# Altium schematic sheet current-regulation.SchDoc
size A4
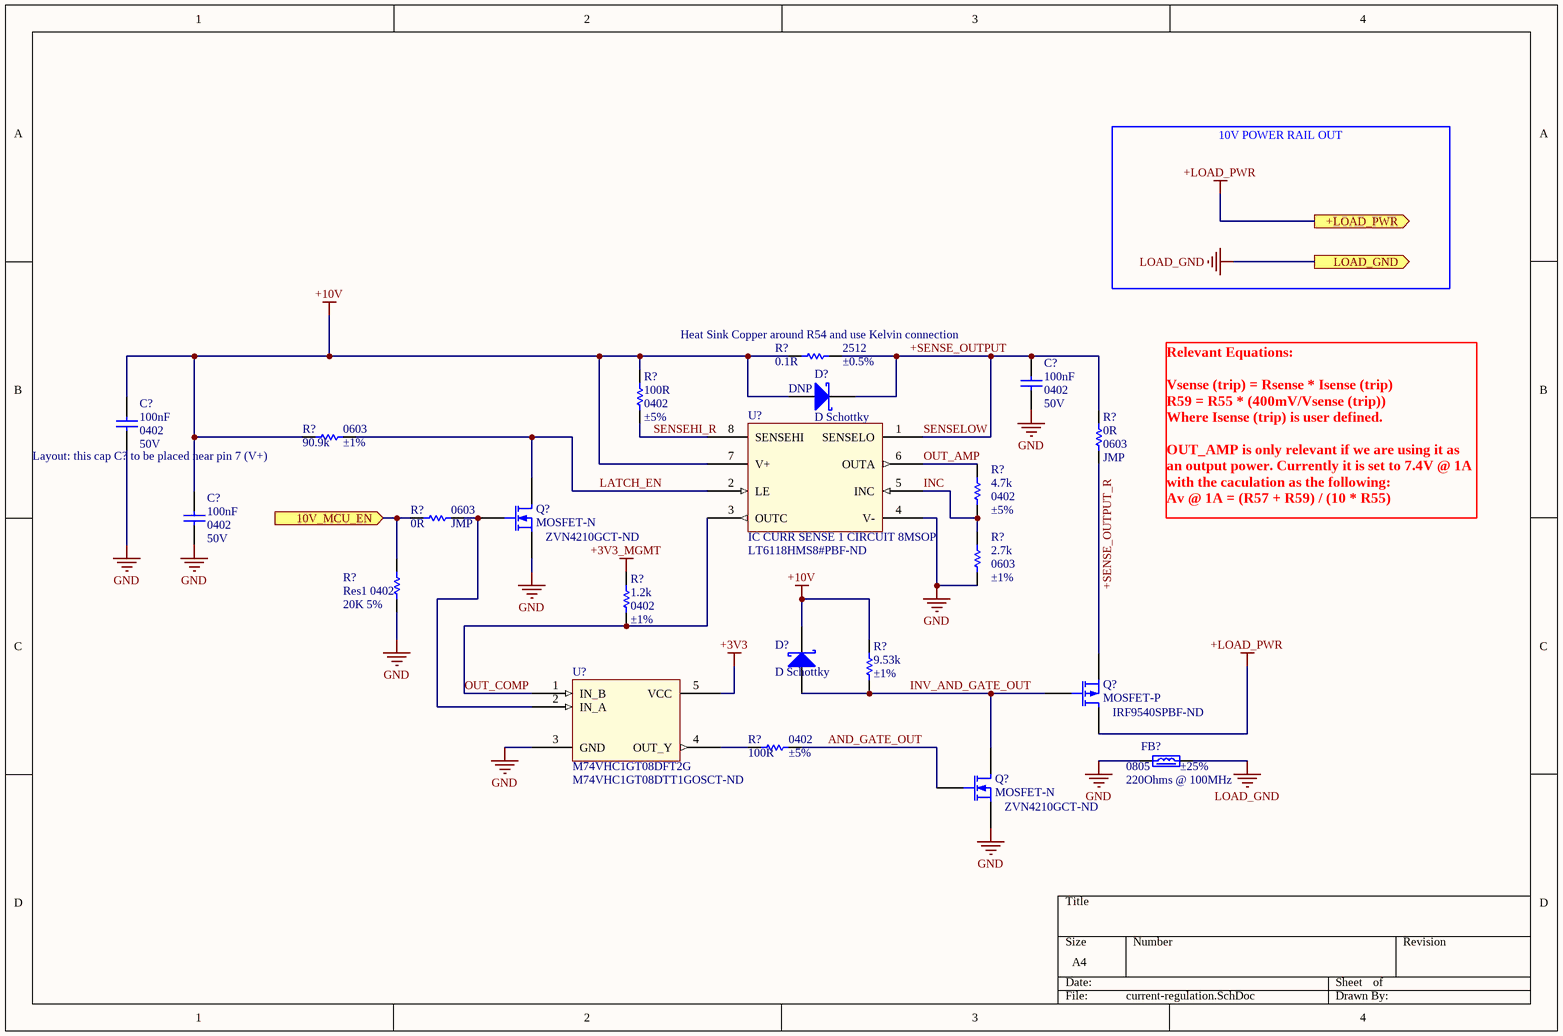
[diagram p0: current-regulation.SchDoc]

## Parts
(Parts that share a designator on the sheet are numbered #1, #2 ... from top to bottom, then left to right.)
C?#1  value 100nF  Package: 0402  Voltage: 50V  [C_1005_0402]  (hidden comment: CAP_NON_POLAR)
C?#2  value 100nF  Package: 0402  Voltage: 50V  [C_1005_0402]  (hidden comment: CAP_NON_POLAR)
C?#3  value 100nF  Package: 0402  Voltage: 50V  [C_1005_0402]  (hidden comment: CAP_NON_POLAR)
D?#1  D Schottky  [SMB]
D?#2  D Schottky  [SMB]
FB?  value 220Ohms @ 100MHz  Package: 0805  Tolerance: ±25%  [FB_2012_0805]  (hidden comment: FERRITE)
Q?#1  MOSFET-N  Supplier Part Number 1: ZVN4210GCT-ND  [E3]
Q?#2  MOSFET-P  Supplier Part Number 1: IRF9540SPBF-ND  [E3]
Q?#3  MOSFET-N  Supplier Part Number 1: ZVN4210GCT-ND  [E3]
R?#1  value 0.1R  Package: 2512  Tolerance: ±0.5%  [R_3216_1206]  (hidden comment: RESISTOR)
R?#2  value 100R  Package: 0402  Tolerance: ±5%  [R_1005_0402]  (hidden comment: RESISTOR)
R?#3  value 0R  Package: 0603  Tolerance: JMP  [R_1608_0603]  (hidden comment: RESISTOR)
R?#4  value 90.9k  Package: 0603  Tolerance: ±1%  [R_1005_0402]  (hidden comment: RESISTOR)
R?#5  value 4.7k  Package: 0402  Tolerance: ±5%  [R_1005_0402]  (hidden comment: RESISTOR)
R?#6  value 0R  Package: 0603  Tolerance: JMP  [R_1608_0603]  (hidden comment: RESISTOR)
R?#7  value 2.7k  Package: 0603  Tolerance: ±1%  [R_1005_0402]  (hidden comment: RESISTOR)
R?#8  value 1.2k  Package: 0402  Tolerance: ±1%  [R_1005_0402]  (hidden comment: RESISTOR)
R?#9  Res1 0402  value 20K 5%  [AXIAL-0.3]
R?#10  value 9.53k  Tolerance: ±1%  [R_1005_0402]  (hidden comment: RESISTOR)
R?#11  value 100R  Package: 0402  Tolerance: ±5%  [R_1005_0402]  (hidden comment: RESISTOR)
U?#1  IC CURR SENSE 1 CIRCUIT 8MSOP  Supplier Part Number 1: LT6118HMS8#PBF-ND  [SOP65P300X125-8N]
U?#2  M74VHC1GT08DFT2G  Supplier Part Number 1: M74VHC1GT08DTT1GOSCT-ND  [SOT-25]

## Ports
10V_MCU_EN (in), +LOAD_PWR (out), LOAD_GND (out)

## Nets
+3V3: U?#2.5(VCC)
+3V3_MGMT: R?#8.1
+10V: C?#2.1 C?#3.1 D?#1.1(A) D?#2.2(K) R?#1.2 R?#2.1 R?#4.2 R?#10.1 U?#1.7(V+)
+LOAD_PWR: Q?#2.1(D) ; port +LOAD_PWR
GND: C?#1.2 C?#2.2 C?#3.2 FB?.1 Q?#1.3(S) Q?#3.3(S) R?#7.2 R?#9.1 U?#1.4(V-) U?#2.3(GND)
LOAD_GND: FB?.2 ; port LOAD_GND
10V_MCU_EN: R?#6.1 R?#9.2 ; port 10V_MCU_EN
+SENSE_OUTPUT: C?#1.1 D?#1.2(K) R?#1.1 R?#3.1 U?#1.1(SENSELO)  [also labelled SENSELOW]
+SENSE_OUTPUT_R: Q?#2.3(S) R?#3.2
AND_GATE_OUT: Q?#3.2(G) R?#11.2
INC: R?#5.1 R?#7.1 U?#1.5(INC)
INV_AND_GATE_OUT: D?#2.1(A) Q?#2.2(G) Q?#3.1(D) R?#10.2
LATCH_EN: Q?#1.1(D) R?#4.1 U?#1.2(LE)
OUT_AMP: R?#5.2 U?#1.6(OUTA)
OUT_COMP: R?#8.2 U?#1.3(OUTC) U?#2.1(IN_B)
SENSEHI_R: R?#2.2 U?#1.8(SENSEHI)
NetQ?#1_2: Q?#1.2(G) R?#6.2 U?#2.2(IN_A)
NetR?#11_1: R?#11.1 U?#2.4(OUT_Y)

## Notes on the sheet
- 10V POWER RAIL OUT
- (near R?#1) Heat Sink Copper around R54 and use Kelvin connection
- (near D?#1) DNP
- Layout: this cap C? to be placed near pin 7 (V+)
- Relevant Equations:
  Vsense (trip) = Rsense * Isense (trip)
  R59 = R55 * (400mV/Vsense (trip))
  Where Isense (trip) is user defined.
  OUT_AMP is only relevant if we are using it as an output power. Currently it is set to 7.4V @ 1A with the caculation as the following:
  Av @ 1A = (R57 + R59) / (10 * R55)

## Library data of the parts
C?#1-C?#3 = 120-00007: CHIP CAP X7R 0.1UF 50V +/-10% 0402 T&R ROHS; Manufacturer1: Murata; Manufacturer_Part_Number1: GRM155R71H104KE14D; Type: Ceramic; Tolerance: ±10%; ecobee P/N: 120-00007; Manufacturer2: Murata; Manufacturer_Part_Number2: GRM155R61H104KE19D; Manufacturer3: TDK; Manufacturer_Part_Number3: C1005X5R1H104KT000F; Temp Coefficient: X7R; Height: 0.55mm
D?#1 D?#2 = D Schottky: Schottky Diode; Published: 8-Jun-2000; LatestRevisionDate: 17-Jul-2002; LatestRevisionNote: Re-released for DXP Platform.; PackageReference: SMB; Publisher: Altium Limited; PackageDescription: DO-214-AA/SMB; 2 C-Bend Leads; Body 5.3 x 3.6 mm, inc. leads (LxW); Code_JEDEC: DO-214-AA
FB? = 155-00002: FERRITE BEAD 220 OHM +/-25% 2A 0805 ROHS; Manufacturer1: Murata; Manufacturer_Part_Number1: BLM21PG221SN1D; ecobee P/N: 155-00002; Type: Ferrite Bead; Current: 2A; Height: 1.05mm
Q?#1 Q?#3 = MOSFET-N: N-Channel MOSFET; Published: 8-Jun-2000; LatestRevisionDate: 17-Jul-2002; LatestRevisionNote: Re-released for DXP Platform.; PackageVersion: 1995/1996; PackageReference: E3; Publisher: Altium Limited; PackageDescription: TO, Flat Index; 3 In-Line, Axial Leads; Body Dia. 4.6mm; Lead Dia. 0.5 mm (max); Supplier 1: Digi-Key
Q?#2 = MOSFET-P: P-Channel MOSFET; Published: 8-Jun-2000; LatestRevisionDate: 17-Jul-2002; LatestRevisionNote: Re-released for DXP Platform.; PackageVersion: 1995/1996; PackageReference: E3; Publisher: Altium Limited; PackageDescription: TO, Flat Index; 3 In-Line, Axial Leads; Body Dia. 4.6mm; Lead Dia. 0.5 mm (max); Supplier 1: Digi-Key
R?#1 = 180-00192: RES 0.1 OHM 1% 1/4W 2512; Manufacturer1: Yageo; Manufacturer_Part_Number1: PT1206FR-070R1L; ecobee P/N: 180-00192; Supplier 1: Digi-Key; Supplier Part Number 1: 311-0.1ANTR-ND; Type: Current Sense; Power: 1/4W; Height: 0.65mm
R?#2 R?#11 = 180-00077: RES 100 OHM 1/16W 0402 +/-5% T&R ROHS; Manufacturer1: RALEC; Manufacturer_Part_Number1: RTT02101JTH; ecobee P/N: 180-00077; Manufacturer2: TA-I Technology; Manufacturer_Part_Number2: RM04JTN101; Manufacturer3: Yageo; Manufacturer_Part_Number3: RC0402JR-07100RL; Type: Resistor; Power: 1/16W; Height: 0.40mm
R?#3 R?#6 = 180-00222: RES 0 OHM JUMPER 1/10W 0603; Manufacturer1: Vishay Dale; Manufacturer_Part_Number1: CRCW06030000Z0EBC; ecobee P/N: 180-00222; Manufacturer2: Yageo; Manufacturer_Part_Number2: RC0603JR-070RL; Supplier 1: Digi-Key; Supplier Part Number 1: 541-4013-2-ND; Type: Resistor; Power: 1/10W; Height: 0.55mm
R?#4 = 180-00207: RES 90.9KOHM 1/16W 0402 +/-1% T&R ROHS RALEC; Manufacturer_Part_Number1: RTT021002FTH; ecobee P/N: 180-00207; Manufacturer1: RALEC; Type: Resistor; Power: 1/16W; Height: 0.40mm
R?#5 = 180-00169: RALEC RES 4.7K OHM 1/16W 0402 +/-5% T&R ROHS; Manufacturer_Part_Number1: RTT02472JTH; ecobee P/N: 180-00169; Manufacturer1: RALEC; Type: Resistor; Power: 1/16W; Height: 0.40mm
R?#7 = 180-00026: RES 2.7K 1/16W  0402 +/-1% T&R ROHS; Manufacturer1: Yageo; Manufacturer_Part_Number1: RC0402FR-072K7L; ecobee P/N: 180-00026; Type: Resistor; Power: 1/16W; Height: 0.40mm
R?#8 = 180-00169: RALEC RES 1.2K OHM 1/16W 0402 +/-1%; Manufacturer_Part_Number1: RTT02472JTH; ecobee P/N: 180-00169; Manufacturer1: RALEC; Type: Resistor; Power: 1/16W; Height: 0.40mm
R?#9 = Res1: Resistor; Published: 8-Jun-2000; LatestRevisionDate: 17-Jul-2002; LatestRevisionNote: Re-released for DXP Platform.; PackageReference: AXIAL-0.3; Publisher: Altium Limited; PackageDescription: Axial Device, Thru-Hole; 2 Leads; 0.3 in Pin Spacing
R?#10 = 180-00207: RES 9.53KOHM 1/16W 0402 +/-1% T&R ROHS RALEC; Manufacturer_Part_Number1: RTT021002FTH; ecobee P/N: 180-00207; Manufacturer1: RALEC; Type: Resistor; Power: 1/16W; Height: 0.40mm
U?#1 = LT6118: Current Sense Amplifier, / Reference and Comparator / with Power-On Reset; ComponentLink1Description: Datasheet; ComponentLink1URL: https://www.analog.com/media/en/technical-documentation/data-sheets/6118f.pdf; Supplier 1: Digi-Key
U?#2 = MC74VHC1GT08: AND Gate IC 1 Channel SC-88A (SC-70-5/SOT-353); Supplier 1: Digi-Key; ComponentLink1Description: Datasheet; ComponentLink1URL: https://www.onsemi.com/pub/Collateral/MC74VHC1GT08-D.PDF